# Altium schematic sheet SIK-DIP-board.SchDoc: SIK-DIP-board
size 270 x 204 mm; Origin: Eagle; Date: 5/6/2021 5:06:37 PM; SheetNumber: 1; GateName_1: G$1; SymbolName_1: LETTER_L; LibraryName: SparkFun-Aesthetics; DeviceSetName: FRAME-LETTER; GateName_2: G$2; SymbolName_2: DOCFIELD; Sheet: Sheet:; REV: REV:; ReleasedundertheCreativeCommons: Released under the Creative Commons; AttributionShare-Alike3.0License: Attribution Share-Alike 3.0 License; http://creativecommons.org/licenses/by-sa/3.0: http://creativecommons.org/licenses/by-sa/3.0; Designby: Design by:
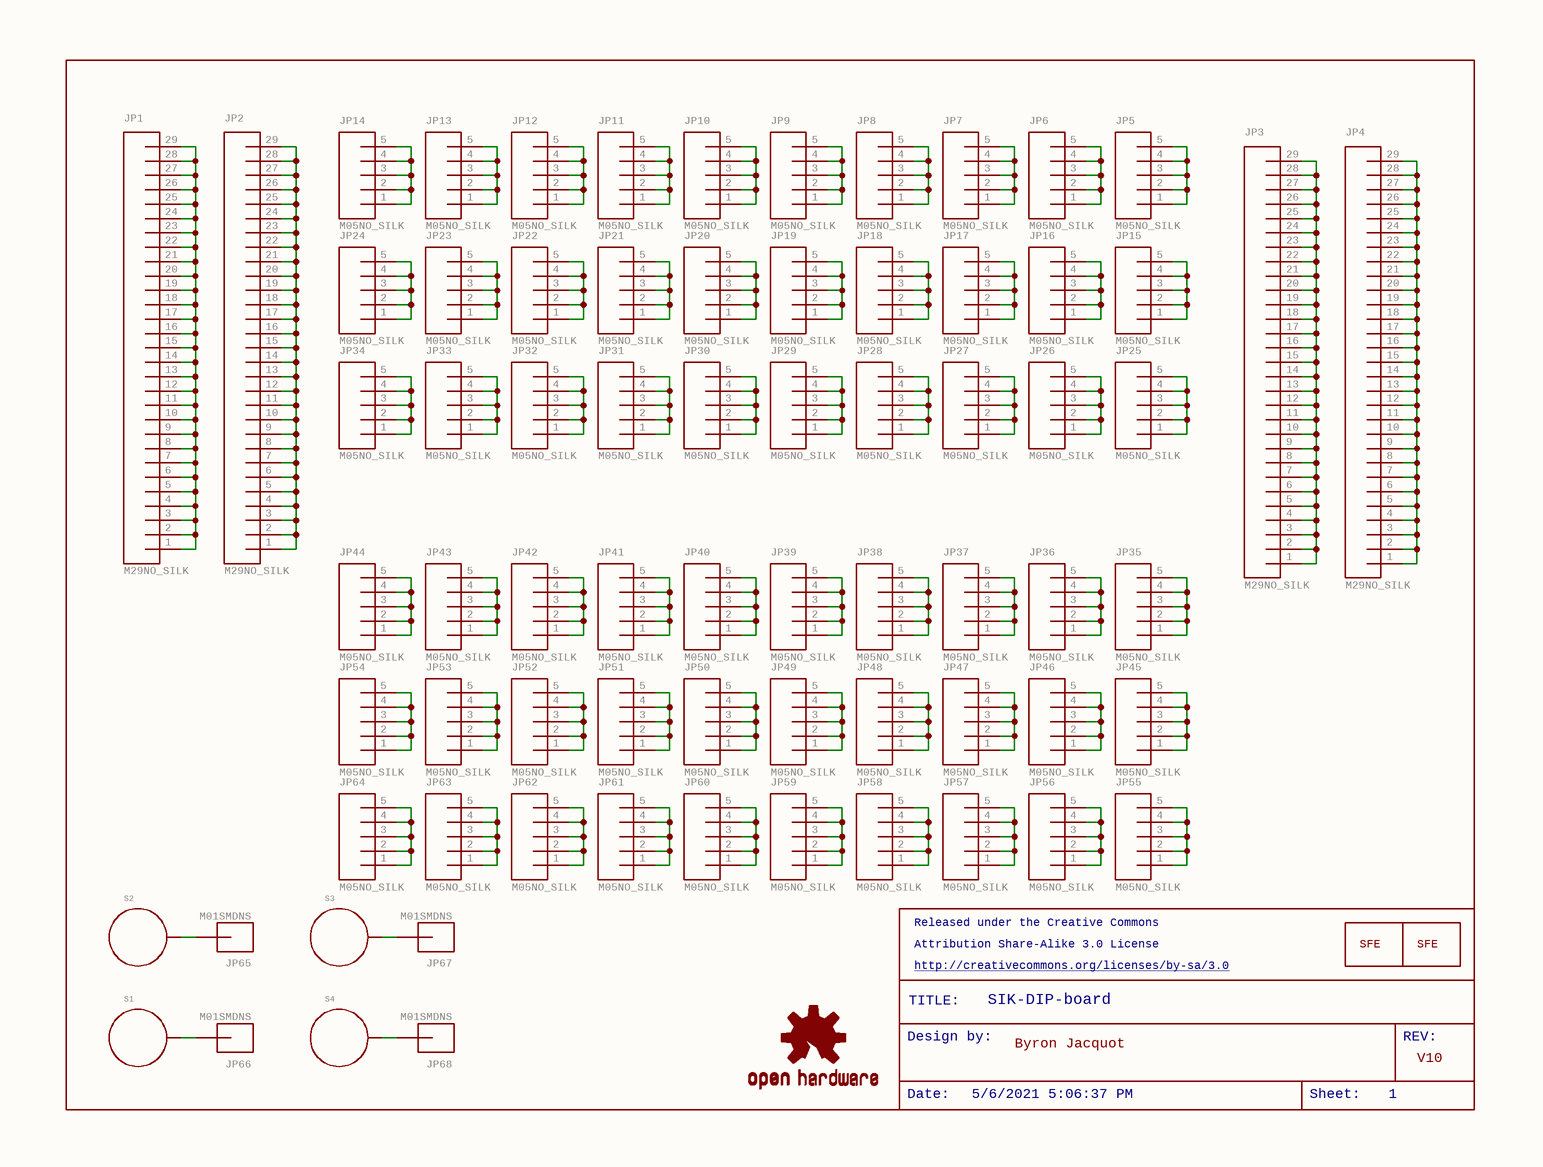
[diagram p0: SIK-DIP-board.SchDoc]

## Parts
JP1  M29NO_SILK  [1X29_NO_SILK]
JP2  M29NO_SILK  [1X29_NO_SILK]
JP3  M29NO_SILK  [1X29_NO_SILK]
JP4  M29NO_SILK  [1X29_NO_SILK]
JP5  M05NO_SILK  [1X05_NO_SILK]
JP6  M05NO_SILK  [1X05_NO_SILK]
JP7  M05NO_SILK  [1X05_NO_SILK]
JP8  M05NO_SILK  [1X05_NO_SILK]
JP9  M05NO_SILK  [1X05_NO_SILK]
JP10  M05NO_SILK  [1X05_NO_SILK]
JP11  M05NO_SILK  [1X05_NO_SILK]
JP12  M05NO_SILK  [1X05_NO_SILK]
JP13  M05NO_SILK  [1X05_NO_SILK]
JP14  M05NO_SILK  [1X05_NO_SILK]
JP15  M05NO_SILK  [1X05_NO_SILK]
JP16  M05NO_SILK  [1X05_NO_SILK]
JP17  M05NO_SILK  [1X05_NO_SILK]
JP18  M05NO_SILK  [1X05_NO_SILK]
JP19  M05NO_SILK  [1X05_NO_SILK]
JP20  M05NO_SILK  [1X05_NO_SILK]
JP21  M05NO_SILK  [1X05_NO_SILK]
JP22  M05NO_SILK  [1X05_NO_SILK]
JP23  M05NO_SILK  [1X05_NO_SILK]
JP24  M05NO_SILK  [1X05_NO_SILK]
JP25  M05NO_SILK  [1X05_NO_SILK]
JP26  M05NO_SILK  [1X05_NO_SILK]
JP27  M05NO_SILK  [1X05_NO_SILK]
JP28  M05NO_SILK  [1X05_NO_SILK]
JP29  M05NO_SILK  [1X05_NO_SILK]
JP30  M05NO_SILK  [1X05_NO_SILK]
JP31  M05NO_SILK  [1X05_NO_SILK]
JP32  M05NO_SILK  [1X05_NO_SILK]
JP33  M05NO_SILK  [1X05_NO_SILK]
JP34  M05NO_SILK  [1X05_NO_SILK]
JP35  M05NO_SILK  [1X05_NO_SILK]
JP36  M05NO_SILK  [1X05_NO_SILK]
JP37  M05NO_SILK  [1X05_NO_SILK]
JP38  M05NO_SILK  [1X05_NO_SILK]
JP39  M05NO_SILK  [1X05_NO_SILK]
JP40  M05NO_SILK  [1X05_NO_SILK]
JP41  M05NO_SILK  [1X05_NO_SILK]
JP42  M05NO_SILK  [1X05_NO_SILK]
JP43  M05NO_SILK  [1X05_NO_SILK]
JP44  M05NO_SILK  [1X05_NO_SILK]
JP45  M05NO_SILK  [1X05_NO_SILK]
JP46  M05NO_SILK  [1X05_NO_SILK]
JP47  M05NO_SILK  [1X05_NO_SILK]
JP48  M05NO_SILK  [1X05_NO_SILK]
JP49  M05NO_SILK  [1X05_NO_SILK]
JP50  M05NO_SILK  [1X05_NO_SILK]
JP51  M05NO_SILK  [1X05_NO_SILK]
JP52  M05NO_SILK  [1X05_NO_SILK]
JP53  M05NO_SILK  [1X05_NO_SILK]
JP54  M05NO_SILK  [1X05_NO_SILK]
JP55  M05NO_SILK  [1X05_NO_SILK]
JP56  M05NO_SILK  [1X05_NO_SILK]
JP57  M05NO_SILK  [1X05_NO_SILK]
JP58  M05NO_SILK  [1X05_NO_SILK]
JP59  M05NO_SILK  [1X05_NO_SILK]
JP60  M05NO_SILK  [1X05_NO_SILK]
JP61  M05NO_SILK  [1X05_NO_SILK]
JP62  M05NO_SILK  [1X05_NO_SILK]
JP63  M05NO_SILK  [1X05_NO_SILK]
JP64  M05NO_SILK  [1X05_NO_SILK]
JP65  M01SMDNS  [1X01NS]
JP66  M01SMDNS  [1X01NS]
JP67  M01SMDNS  [1X01NS]
JP68  M01SMDNS  [1X01NS]
LOGO1  LOGO-SFECP  [SFE-LOGO-FLAME-COPPER]  (value not drawn)
LOGO2  LOGO-SFENEW  [SFE-NEW-WEBLOGO]  (value not drawn)
LOGO3  OSHW-LOGOS  [OSHW-LOGO-S]  (value not drawn)
S1  STANDOFF_ELECTRICAL  [STANDOFF-ELECTRICAL]  (value not drawn)
S2  STANDOFF_ELECTRICAL  [STANDOFF-ELECTRICAL]  (value not drawn)
S3  STANDOFF_ELECTRICAL  [STANDOFF-ELECTRICAL]  (value not drawn)
S4  STANDOFF_ELECTRICAL  [STANDOFF-ELECTRICAL]  (value not drawn)

## Nets
NetJP1_1: JP1.1 JP1.2 JP1.3 JP1.4 JP1.5 JP1.6 JP1.7 JP1.8 JP1.9 JP1.10 JP1.11 JP1.12 JP1.13 JP1.14 JP1.15 JP1.16 JP1.17 JP1.18 JP1.19 JP1.20 JP1.21 JP1.22 JP1.23 JP1.24 JP1.25 JP1.26 JP1.27 JP1.28 JP1.29
NetJP2_1: JP2.1 JP2.2 JP2.3 JP2.4 JP2.5 JP2.6 JP2.7 JP2.8 JP2.9 JP2.10 JP2.11 JP2.12 JP2.13 JP2.14 JP2.15 JP2.16 JP2.17 JP2.18 JP2.19 JP2.20 JP2.21 JP2.22 JP2.23 JP2.24 JP2.25 JP2.26 JP2.27 JP2.28 JP2.29
NetJP3_1: JP3.1 JP3.2 JP3.3 JP3.4 JP3.5 JP3.6 JP3.7 JP3.8 JP3.9 JP3.10 JP3.11 JP3.12 JP3.13 JP3.14 JP3.15 JP3.16 JP3.17 JP3.18 JP3.19 JP3.20 JP3.21 JP3.22 JP3.23 JP3.24 JP3.25 JP3.26 JP3.27 JP3.28 JP3.29
NetJP4_1: JP4.1 JP4.2 JP4.3 JP4.4 JP4.5 JP4.6 JP4.7 JP4.8 JP4.9 JP4.10 JP4.11 JP4.12 JP4.13 JP4.14 JP4.15 JP4.16 JP4.17 JP4.18 JP4.19 JP4.20 JP4.21 JP4.22 JP4.23 JP4.24 JP4.25 JP4.26 JP4.27 JP4.28 JP4.29
NetJP5_1: JP5.1 JP5.2 JP5.3 JP5.4 JP5.5
NetJP6_1: JP6.1 JP6.2 JP6.3 JP6.4 JP6.5
NetJP7_1: JP7.1 JP7.2 JP7.3 JP7.4 JP7.5
NetJP8_1: JP8.1 JP8.2 JP8.3 JP8.4 JP8.5
NetJP9_1: JP9.1 JP9.2 JP9.3 JP9.4 JP9.5
NetJP10_1: JP10.1 JP10.2 JP10.3 JP10.4 JP10.5
NetJP11_1: JP11.1 JP11.2 JP11.3 JP11.4 JP11.5
NetJP12_1: JP12.1 JP12.2 JP12.3 JP12.4 JP12.5
NetJP13_1: JP13.1 JP13.2 JP13.3 JP13.4 JP13.5
NetJP14_1: JP14.1 JP14.2 JP14.3 JP14.4 JP14.5
NetJP15_1: JP15.1 JP15.2 JP15.3 JP15.4 JP15.5
NetJP16_1: JP16.1 JP16.2 JP16.3 JP16.4 JP16.5
NetJP17_1: JP17.1 JP17.2 JP17.3 JP17.4 JP17.5
NetJP18_1: JP18.1 JP18.2 JP18.3 JP18.4 JP18.5
NetJP19_1: JP19.1 JP19.2 JP19.3 JP19.4 JP19.5
NetJP20_1: JP20.1 JP20.2 JP20.3 JP20.4 JP20.5
NetJP21_1: JP21.1 JP21.2 JP21.3 JP21.4 JP21.5
NetJP22_1: JP22.1 JP22.2 JP22.3 JP22.4 JP22.5
NetJP23_1: JP23.1 JP23.2 JP23.3 JP23.4 JP23.5
NetJP24_1: JP24.1 JP24.2 JP24.3 JP24.4 JP24.5
NetJP25_1: JP25.1 JP25.2 JP25.3 JP25.4 JP25.5
NetJP26_1: JP26.1 JP26.2 JP26.3 JP26.4 JP26.5
NetJP27_1: JP27.1 JP27.2 JP27.3 JP27.4 JP27.5
NetJP28_1: JP28.1 JP28.2 JP28.3 JP28.4 JP28.5
NetJP29_1: JP29.1 JP29.2 JP29.3 JP29.4 JP29.5
NetJP30_1: JP30.1 JP30.2 JP30.3 JP30.4 JP30.5
NetJP31_1: JP31.1 JP31.2 JP31.3 JP31.4 JP31.5
NetJP32_1: JP32.1 JP32.2 JP32.3 JP32.4 JP32.5
NetJP33_1: JP33.1 JP33.2 JP33.3 JP33.4 JP33.5
NetJP34_1: JP34.1 JP34.2 JP34.3 JP34.4 JP34.5
NetJP35_1: JP35.1 JP35.2 JP35.3 JP35.4 JP35.5
NetJP36_1: JP36.1 JP36.2 JP36.3 JP36.4 JP36.5
NetJP37_1: JP37.1 JP37.2 JP37.3 JP37.4 JP37.5
NetJP38_1: JP38.1 JP38.2 JP38.3 JP38.4 JP38.5
NetJP39_1: JP39.1 JP39.2 JP39.3 JP39.4 JP39.5
NetJP40_1: JP40.1 JP40.2 JP40.3 JP40.4 JP40.5
NetJP41_1: JP41.1 JP41.2 JP41.3 JP41.4 JP41.5
NetJP42_1: JP42.1 JP42.2 JP42.3 JP42.4 JP42.5
NetJP43_1: JP43.1 JP43.2 JP43.3 JP43.4 JP43.5
NetJP44_1: JP44.1 JP44.2 JP44.3 JP44.4 JP44.5
NetJP45_1: JP45.1 JP45.2 JP45.3 JP45.4 JP45.5
NetJP46_1: JP46.1 JP46.2 JP46.3 JP46.4 JP46.5
NetJP47_1: JP47.1 JP47.2 JP47.3 JP47.4 JP47.5
NetJP48_1: JP48.1 JP48.2 JP48.3 JP48.4 JP48.5
NetJP49_1: JP49.1 JP49.2 JP49.3 JP49.4 JP49.5
NetJP50_1: JP50.1 JP50.2 JP50.3 JP50.4 JP50.5
NetJP51_1: JP51.1 JP51.2 JP51.3 JP51.4 JP51.5
NetJP52_1: JP52.1 JP52.2 JP52.3 JP52.4 JP52.5
NetJP53_1: JP53.1 JP53.2 JP53.3 JP53.4 JP53.5
NetJP54_1: JP54.1 JP54.2 JP54.3 JP54.4 JP54.5
NetJP55_1: JP55.1 JP55.2 JP55.3 JP55.4 JP55.5
NetJP56_1: JP56.1 JP56.2 JP56.3 JP56.4 JP56.5
NetJP57_1: JP57.1 JP57.2 JP57.3 JP57.4 JP57.5
NetJP58_1: JP58.1 JP58.2 JP58.3 JP58.4 JP58.5
NetJP59_1: JP59.1 JP59.2 JP59.3 JP59.4 JP59.5
NetJP60_1: JP60.1 JP60.2 JP60.3 JP60.4 JP60.5
NetJP61_1: JP61.1 JP61.2 JP61.3 JP61.4 JP61.5
NetJP62_1: JP62.1 JP62.2 JP62.3 JP62.4 JP62.5
NetJP63_1: JP63.1 JP63.2 JP63.3 JP63.4 JP63.5
NetJP64_1: JP64.1 JP64.2 JP64.3 JP64.4 JP64.5
NetJP65_1: JP65.1 S2.P1(P$1)
NetJP66_1: JP66.1 S1.P1(P$1)
NetJP67_1: JP67.1 S3.P1(P$1)
NetJP68_1: JP68.1 S4.P1(P$1)

## Notes on the sheet
- Released under the Creative Commons
- Attribution Share-Alike 3.0 License
- http://creativecommons.org/licenses/by-sa/3.0
- Design by:
- TITLE:
- SIK-DIP-board
- Byron Jacquot
- REV:
- Date:
- 5/6/2021 5:06:37 PM
- Sheet:
- 1
- V10

## Library data of the parts
JP1-JP4 = M29NO_SILK: 1x29 .1" header; GateName_1: G$1; SymbolName_1: M29; DeviceName: NO_SILK; LibraryName: SparkFun-Connectors; DeviceSetName: M29
JP5-JP64 = M05NO_SILK: Header 5Standard 5-pin 0.1" header. Use with straight break away headers (SKU : PRT-00116), right angle break away headers (PRT-00553), swiss pins (PRT-00743), machine pins (PRT-00117), and female headers (PRT-00115). Molex polarized connector foot print use with SKU : PRT-08230 with associated crimp pins and housings.; GateName_1: G$1; SymbolName_1: M05; DeviceName: NO_SILK; LibraryName: SparkFun-Connectors; DeviceSetName: M05
JP65-JP68 = M01SMDNS: Header 1Standard 1-pin 0.1" header. Use with straight break away headers (SKU : PRT-00116), right angle break away headers (PRT-00553), swiss pins (PRT-00743), machine pins (PRT-00117), and female headers (PRT-00115).; GateName_1: G$1; SymbolName_1: M01; DeviceName: SMDNS; LibraryName: SparkFun-Connectors; DeviceSetName: M01
LOGO1 = LOGO-SFECP: Spark Fun Electronics PCB LogoThis is the standard Spark Fun Electronics PCB logo.; GateName_1: G$1; SymbolName_1: LOGO1; DeviceName: CP; LibraryName: SparkFun-Aesthetics; DeviceSetName: LOGO-SFE; SFE: SFE
LOGO2 = LOGO-SFENEW: Spark Fun Electronics PCB LogoThis is the standard Spark Fun Electronics PCB logo.; GateName_1: G$1; SymbolName_1: LOGO1; DeviceName: NEW; LibraryName: SparkFun-Aesthetics; DeviceSetName: LOGO-SFE; SFE: SFE
LOGO3 = OSHW-LOGOS: Open Source Hardware Logo This logo indicates the piece of hardware it is found on incorporates a OSHW license and/or adheres to the definition of open source hardware found here: http://freedomdefined.org/OSHW; GateName_1: G$1; DeviceName: S; SymbolName_1: OSHW-LOGO; LibraryName: SparkFun-Aesthetics; DeviceSetName: OSHW-LOGO
S1-S4 = STANDOFF_ELECTRICAL: A standoff intended to be an electrically connected point. Pad size and stop size allow for a #4 Phillips pan screw head to make a solid connection to the board.; GateName_1: G$1; SymbolName_1: STANDOFF_ELECTRICAL; LibraryName: SparkFun-Electromechanical; DeviceSetName: STANDOFF_ELECTRICAL